# Altium schematic sheet 18650_13s8p.SchDoc
size A3
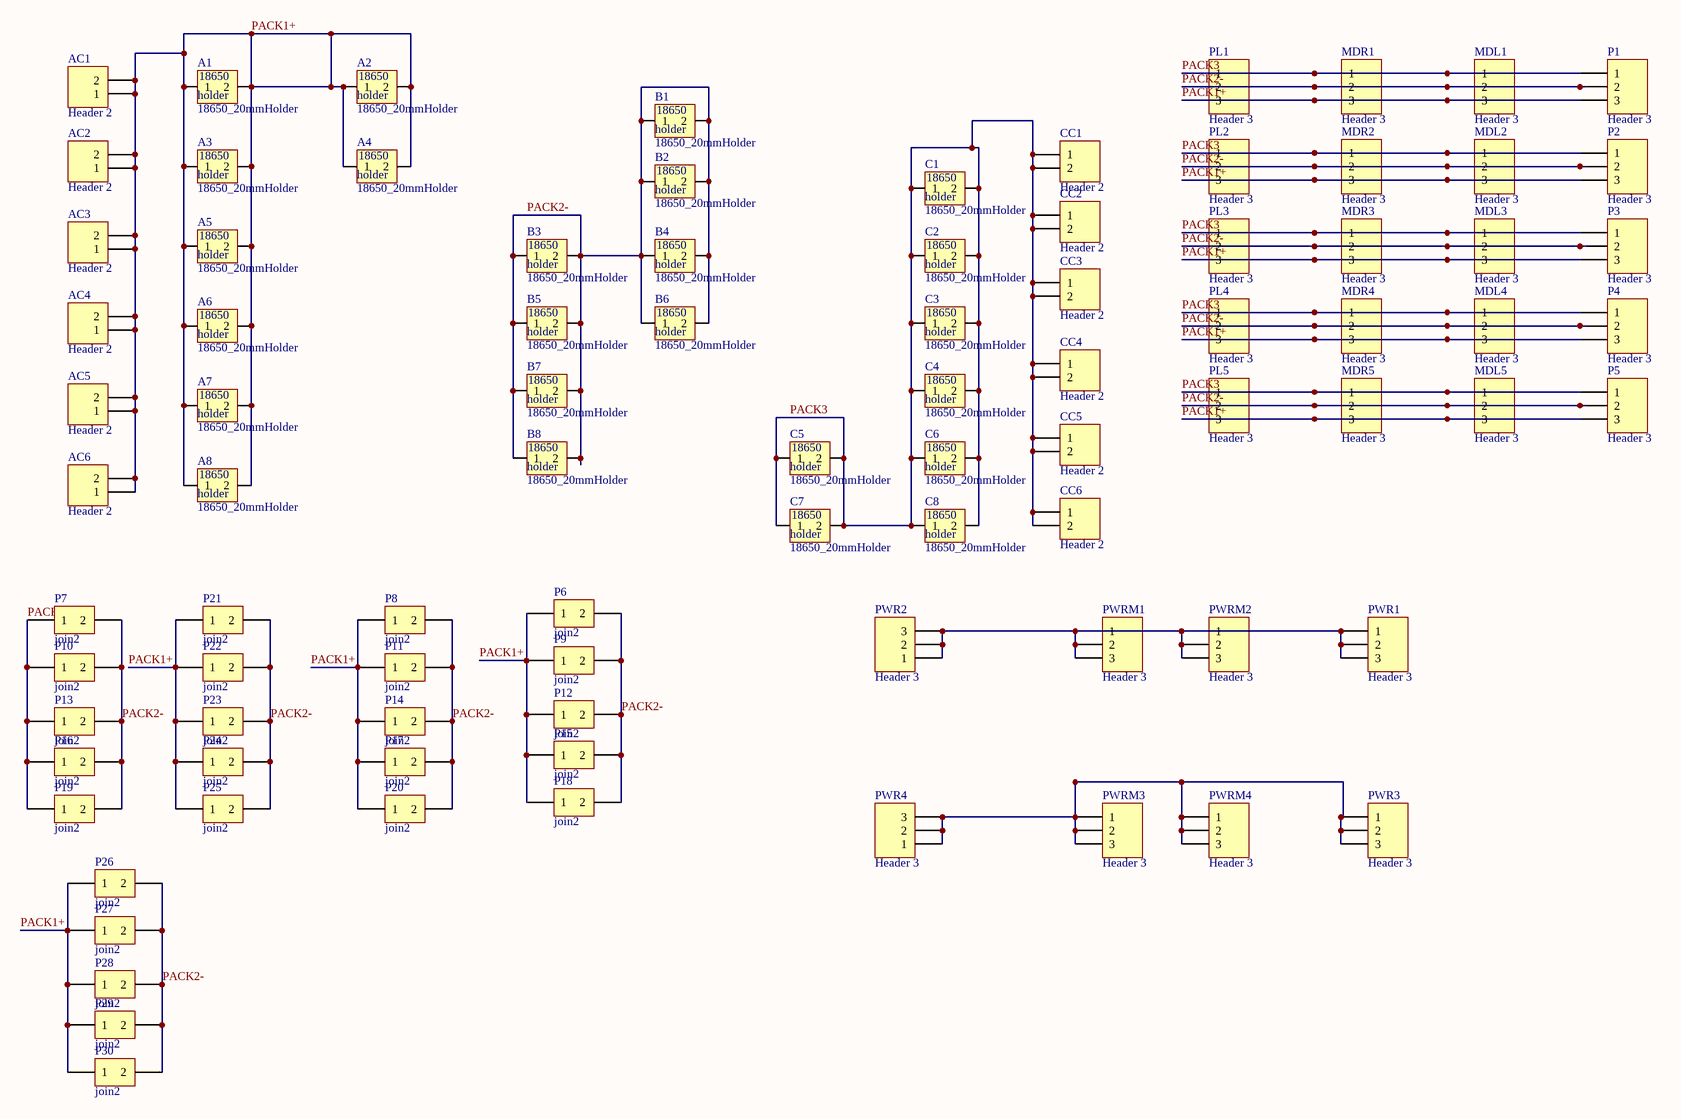
[diagram p0: 18650_13s8p.SchDoc]

## Parts
A1  18650_20mmHolder  [18650holder20_2]
A2  18650_20mmHolder  [18650holder20_2]
A3  18650_20mmHolder  [18650holder20_2]
A4  18650_20mmHolder  [18650holder20_2]
A5  18650_20mmHolder  [18650holder20_2]
A6  18650_20mmHolder  [18650holder20_2]
A7  18650_20mmHolder  [18650holder20_2]
A8  18650_20mmHolder  [18650holder20_2]
AC1  Header 2  [HDR1X2]
AC2  Header 2  [HDR1X2]
AC3  Header 2  [HDR1X2]
AC4  Header 2  [HDR1X2]
AC5  Header 2  [HDR1X2]
AC6  Header 2  [HDR1X2]
B1  18650_20mmHolder  [18650holder20_2]
B2  18650_20mmHolder  [18650holder20_2]
B3  18650_20mmHolder  [18650holder20_2]
B4  18650_20mmHolder  [18650holder20_2]
B5  18650_20mmHolder  [18650holder20_2]
B6  18650_20mmHolder  [18650holder20_2]
B7  18650_20mmHolder  [18650holder20_2]
B8  18650_20mmHolder  [18650holder20_2]
C1  18650_20mmHolder  [18650holder20_2]
C2  18650_20mmHolder  [18650holder20_2]
C3  18650_20mmHolder  [18650holder20_2]
C4  18650_20mmHolder  [18650holder20_2]
C5  18650_20mmHolder  [18650holder20_2]
C6  18650_20mmHolder  [18650holder20_2]
C7  18650_20mmHolder  [18650holder20_2]
C8  18650_20mmHolder  [18650holder20_2]
CC1  Header 2  [HDR1X2]
CC2  Header 2  [HDR1X2]
CC3  Header 2  [HDR1X2]
CC4  Header 2  [HDR1X2]
CC5  Header 2  [HDR1X2]
CC6  Header 2  [HDR1X2]
MDL1  Header 3  [HDR1X3]
MDL2  Header 3  [HDR1X3]
MDL3  Header 3  [HDR1X3]
MDL4  Header 3  [HDR1X3]
MDL5  Header 3  [HDR1X3]
MDR1  Header 3  [HDR1X3]
MDR2  Header 3  [HDR1X3]
MDR3  Header 3  [HDR1X3]
MDR4  Header 3  [HDR1X3]
MDR5  Header 3  [HDR1X3]
P1  Header 3  [HDR1X3]
P2  Header 3  [HDR1X3]
P3  Header 3  [HDR1X3]
P4  Header 3  [HDR1X3]
P5  Header 3  [HDR1X3]
P6  join2  [join2_0603]  (net tie, no BOM)
P7  join2  [join2_0603]  (net tie, no BOM)
P8  join2  [join2_0603]  (net tie, no BOM)
P9  join2  [join2_0603]  (net tie, no BOM)
P10  join2  [join2_0603]  (net tie, no BOM)
P11  join2  [join2_0603]  (net tie, no BOM)
P12  join2  [join2_0603]  (net tie, no BOM)
P13  join2  [join2_0603]  (net tie, no BOM)
P14  join2  [join2_0603]  (net tie, no BOM)
P15  join2  [join2_0603]  (net tie, no BOM)
P16  join2  [join2_0603]  (net tie, no BOM)
P17  join2  [join2_0603]  (net tie, no BOM)
P18  join2  [join2_0603]  (net tie, no BOM)
P19  join2  [join2_0603]  (net tie, no BOM)
P20  join2  [join2_0603]  (net tie, no BOM)
P21  join2  [join2_0603]  (net tie, no BOM)
P22  join2  [join2_0603]  (net tie, no BOM)
P23  join2  [join2_0603]  (net tie, no BOM)
P24  join2  [join2_0603]  (net tie, no BOM)
P25  join2  [join2_0603]  (net tie, no BOM)
P26  join2  [join2_0603]  (net tie, no BOM)
P27  join2  [join2_0603]  (net tie, no BOM)
P28  join2  [join2_0603]  (net tie, no BOM)
P29  join2  [join2_0603]  (net tie, no BOM)
P30  join2  [join2_0603]  (net tie, no BOM)
PL1  Header 3  [HDR1X3]
PL2  Header 3  [HDR1X3]
PL3  Header 3  [HDR1X3]
PL4  Header 3  [HDR1X3]
PL5  Header 3  [HDR1X3]
PWR1  Header 3  [HDR1X3]
PWR2  Header 3  [HDR1X3]
PWR3  Header 3  [HDR1X3]
PWR4  Header 3  [HDR1X3]
PWRM1  Header 3  [HDR1X3]
PWRM2  Header 3  [HDR1X3]
PWRM3  Header 3  [HDR1X3]
PWRM4  Header 3  [HDR1X3]

## Nets
PACK1+: A1.1 A1.2 A2.1 A2.2 A3.1 A3.2 A4.1 A4.2 A5.1 A5.2 A6.1 A6.2 A7.1 A7.2 A8.1 A8.2 AC1.1 AC1.2 AC2.1 AC2.2 AC3.1 AC3.2 AC4.1 AC4.2 AC5.1 AC5.2 AC6.1 AC6.2 MDL1.3 MDL2.3 MDL3.3 MDL4.3 MDL5.3 MDR1.3 MDR2.3 MDR3.3 MDR4.3 MDR5.3 P1.3 P2.3 P3.3 P4.3 P5.3 P6.1 P7.1 P8.1 P9.1 P10.1 P11.1 P12.1 P13.1 P14.1 P15.1 P16.1 P17.1 P18.1 P19.1 P20.1 P21.1 P22.1 P23.1 P24.1 P25.1 P26.1 P27.1 P28.1 P29.1 P30.1 PL1.3 PL2.3 PL3.3 PL4.3 PL5.3
PACK2-: B1.1 B1.2 B2.1 B2.2 B3.1 B3.2 B4.1 B4.2 B5.1 B5.2 B6.1 B6.2 B7.1 B7.2 B8.1 B8.2 MDL1.2 MDL2.2 MDL3.2 MDL4.2 MDL5.2 MDR1.2 MDR2.2 MDR3.2 MDR4.2 MDR5.2 P1.2 P2.2 P3.2 P4.2 P5.2 P6.2 P7.2 P8.2 P9.2 P10.2 P11.2 P12.2 P13.2 P14.2 P15.2 P16.2 P17.2 P18.2 P19.2 P20.2 P21.2 P22.2 P23.2 P24.2 P25.2 P26.2 P27.2 P28.2 P29.2 P30.2 PL1.2 PL2.2 PL3.2 PL4.2 PL5.2
PACK3: C1.1 C1.2 C2.1 C2.2 C3.1 C3.2 C4.1 C4.2 C5.1 C5.2 C6.1 C6.2 C7.1 C7.2 C8.1 C8.2 CC1.1 CC1.2 CC2.1 CC2.2 CC3.1 CC3.2 CC4.1 CC4.2 CC5.1 CC5.2 CC6.1 CC6.2 MDL1.1 MDL2.1 MDL3.1 MDL4.1 MDL5.1 MDR1.1 MDR2.1 MDR3.1 MDR4.1 MDR5.1 P1.1 P2.1 P3.1 P4.1 P5.1 PL1.1 PL2.1 PL3.1 PL4.1 PL5.1
NetPWR1_1: PWR1.1 PWR1.2 PWR1.3 PWR2.1 PWR2.2 PWR2.3 PWRM1.1 PWRM1.2 PWRM1.3 PWRM2.1 PWRM2.2 PWRM2.3
NetPWR3_1: PWR3.1 PWR3.2 PWR3.3 PWR4.1 PWR4.2 PWR4.3 PWRM3.1 PWRM3.2 PWRM3.3 PWRM4.1 PWRM4.2 PWRM4.3

## Notes on the sheet
- (in symbol 18650_20mmHolder) 18650; holder

## Library data of the parts
A1-A8 B1-B8 C1-C8 = 18650_20mmHolder: 20mm holder 18650 sujungimai tiek - tiek pliuso; Published: 24-Mar-1999; LatestRevisionDate: 17-Jul-2002; LatestRevisionNote: Re-released for DXP Platform.; PackageReference: BAT-2; Publisher: Altium Limited; PackageDescription: Battery; 2 Leads
AC1-AC6 CC1-CC6 = Header 2: Header, 2-Pin; LatestRevisionDate: 17-Jul-2002; LatestRevisionNote: Re-released for DXP Platform.; Publisher: Altium Limited
MDL1-MDL5 MDR1-MDR5 P1-P5 PL1-PL5 PWR1-PWR4 PWRM1-PWRM4 = Header 3: Header, 3-Pin; LatestRevisionDate: 17-Jul-2002; LatestRevisionNote: Re-released for DXP Platform.; Publisher: Altium Limited
P6-P30 = join2: Header, 2-Pin; LatestRevisionDate: 17-Jul-2002; LatestRevisionNote: Re-released for DXP Platform.; Publisher: Altium Limited